# Altium schematic sheet Controller.SchDoc: Controle
size A4; ENG_APP_DATE: --/--/--; DSN_APP_DATE: --/--/--; CHK_APP_DATE: --/--/--; Date: *******; ApprovedBy: *******; CheckedBy: None; Author: *******; CompanyName: *******; Engineer: *******; Organization: *******; Address1: *******; Address2: *******; Address3: *******; Address4: *******; DocumentNumber: Doc Num; Revision: *******; SheetNumber: 2; SheetTotal: 7; CurrentTime: *******; CurrentDate: *******; Time: *******; DocumentFullPathAndName: *******; DocumentName: *******; ModifiedDate: *******; ImagePath: *******; ProjectName: *******; Application_BuildNumber: *******
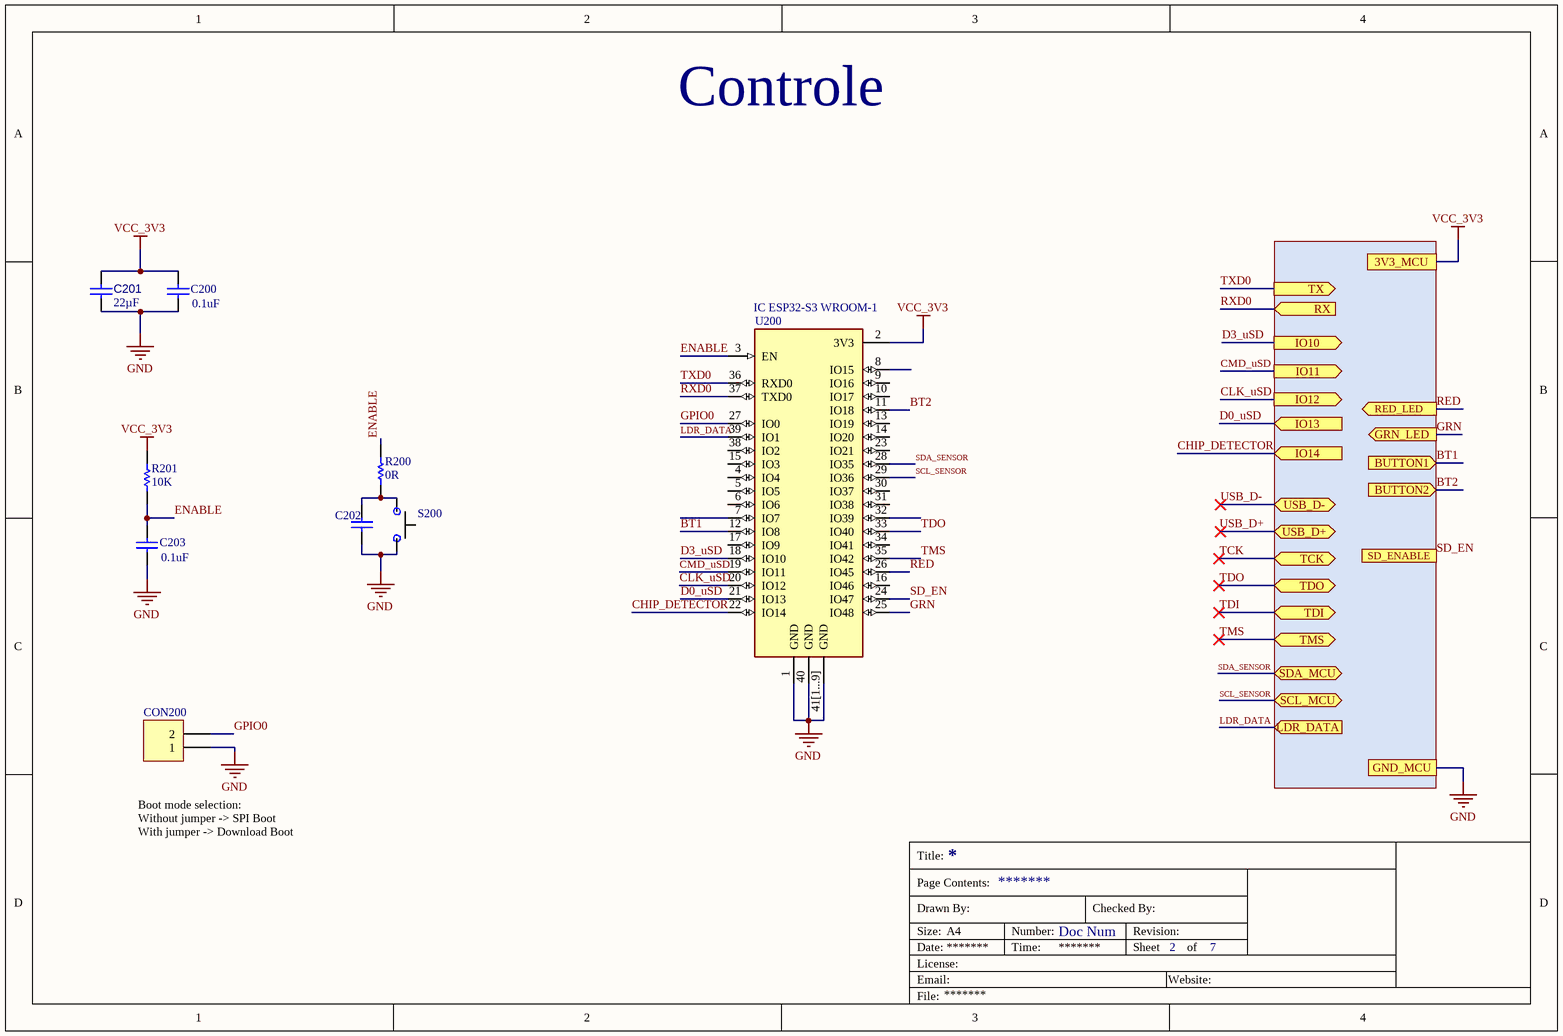
[diagram p0: Controller.SchDoc]

## Parts
C200  0.1uF  [CC2012-0805]
C201  value 22µF  [CC2012-0805]  (hidden comment: Capacitor 22µF +/-40% 16V 0805)
C202  CAP CER 0.1uF 100V X7R SMD 0805  [CC2012-0805]  (value not drawn)
C203  0.1uF  [CC2012-0805]
CON200  PIN HEADER 2POS  [FP-TSW-102-07-G-S-MFG]  (value not drawn)
R200  0R  [RESC2013X50X35ML15T15]
R201  10K  [CR2012-0805]
S200  SWITCH TACTILE SPST-NO 0.05A 12V SMD  [SWITCH_TACTILE_SMD_2PIN]  (value not drawn)
U200  IC ESP32-S3 WROOM-1  [ESP32_S3_WROOM_1]

## Ports
3V3_MCU, BUTTON1 (in), BUTTON2 (in), GND_MCU, GRN_LED (out), IO10 (out), IO11 (out), IO12 (out), IO13 (in), IO14 (in), LDR_DATA (in), RED_LED (out), RX (in), SCL_MCU (bidir), SD_ENABLE (out), SDA_MCU (bidir), TCK (bidir), TDI (bidir), TDO (bidir), TMS (bidir), TX (out), USB_D+ (bidir), USB_D- (bidir)

## Nets
GND: C200.1 C201.1 C202.1 C203.1 CON200.1 S200.1 U200.1(GND) U200.40(GND) U200.41[1...9](GND) ; port GND_MCU
VCC_3V3: C200.2 C201.2 R201.2 U200.2(3V3) ; port 3V3_MCU
BT1: U200.12(IO8) ; port BUTTON1
BT2: U200.11(IO18) ; port BUTTON2
CHIP_DETECTOR: U200.22(IO14) ; port IO14
CLK_uSD: U200.20(IO12) ; port IO12
CMD_uSD: U200.19(IO11) ; port IO11
D0_uSD: U200.21(IO13) ; port IO13
D3_uSD: U200.18(IO10) ; port IO10
ENABLE: C203.2 R200.2 R201.1 U200.3(EN)
GPIO0: CON200.2 U200.27(IO0)
GRN: U200.25(IO48) ; port GRN_LED
LDR_DATA: U200.39(IO1) ; port LDR_DATA
RED: U200.26(IO45) ; port RED_LED
RXD0: U200.37(TXD0) ; port RX
SCL_SENSOR: U200.29(IO36) ; port SCL_MCU
SD_EN: U200.24(IO47) ; port SD_ENABLE
SDA_SENSOR: U200.28(IO35) ; port SDA_MCU
TCK: port TCK
TDI: port TDI
TDO: U200.33(IO40) ; port TDO
TMS: U200.35(IO42) ; port TMS
TXD0: U200.36(RXD0) ; port TX
USB_D-: port USB_D-
NetC202_2: C202.2 R200.1 S200.2

Not connected (* = marked no-connect by the designer): U200 4(IO4) 5(IO5) 6(IO6) 7(IO7) 8(IO15) 9(IO16) 10(IO17) 13(IO19) 14(IO20) 15(IO3) 16(IO46) 17(IO9) 23(IO21) 30(IO37) 31(IO38) 32(IO39) 34(IO41) 38(IO2)

## Notes on the sheet
- (near CON200) Boot mode selection:
  Without jumper -> SPI Boot
  With jumper -> Download Boot
- Labels drawn without touching a wire or pin: USB_D+
- Title:
- Drawn By:
- Page Contents:
- Checked By:
- Size:
- Date:
- File:
- License:
- Email:
- A4
- Number:
- Time:
- Revision:
- Sheet
- Website:
- of

## Library data of the parts
C200 C202 C203 = CAP CER 0.1uF 25V 0805 SMD: Cap Ceramic 0.1uF 25V X7R 10% SMD 0805 125C Plastic T/R; Manufacturer: KEMET; Manufacturer Part Number: C0805C104K3RACTU; Capacitance: 100nF; Supplier 1: RSComponents; RoHS: Yes; Category: Ceramic Capacitors; Stock 1: 1910; Pricing 1: 10=0,13300, 100=0,12200, 250=0,11000, 500=0,09400, 1000=0,08300 (USD); Mount: PCB,Surface Mount; Case/Package: 0805; Case Code (Imperial): 0805; Case Code (Metric): 2012; Dielectric Material: Ceramic; Contact Plating: Tin,Matte; Min Operating Temperature: -55°C; Max Operating Temperature: 125°C; Packaging: Tape and Reel; Tolerance: 10%; Package Quantity: 4000; Voltage Rating: 25V; Series: C0805C; Voltage Rating (DC): 25V; Dielectric: X7R; Termination: SMD/SMT; Construction: Flat; Voltage: 25V; Length: 2mm; Width: 1.2mm; Height: 0.9mm; Depth: 1.25mm; Lead Pitch: 0.75mm; Radiation Hardening: No; RoHS Compliant: Yes; ComponentLink1URL: https://datasheet.ciiva.com/18193/getdatasheetpartid-385649-18193413.pdf?src-supplier=Verical; ComponentLink1Description: https://datasheet.ciiva.com/18193/getdatasheetpartid-385649-18193413.pdf?src-supplier=Verical; ComponentLink2URL: https://datasheet.ciiva.com/7842/kem-c1002-x7r-smd-7842536.pdf?src-supplier=Element14; ComponentLink2Description: https://datasheet.ciiva.com/7842/kem-c1002-x7r-smd-7842536.pdf?src-supplier=Element14; ComponentLink3URL: https://datasheet.ciiva.com/7842/kem-c1002-x7r-smd-7842538.pdf?src-supplier=Element14; ComponentLink3Description: https://datasheet.ciiva.com/7842/kem-c1002-x7r-smd-7842538.pdf?src-supplier=Element14; Supplier Part Number 1: 6480979
C201 = CMP-001-00081-6: Chip Capacitor, 22µF +/-40%, 16V, 0805, Thickness 1.45 mm; Tolerance: 5%; Mounting Technology: SMT; Min Operating Temperature: -55°C; Case/Package: 0805; Max Operating Temperature: 85°C; Voltage Rating: 16V; Pins: 2
CON200 = CMP-002-00076-1: Conn Unshrouded Header HDR 2 POS 2.54mm Solder ST Top Entry Thru-Hole Bulk; Manufacturer Part Number: TSW-102-07-G-S; Gender: Male; Connector Type: Male Pin; Max Current Rating: 7.6A; Number of Contacts: 2; Max Voltage Rating (AC): 550V; Length: 5.08mm; Depth: 2.54mm; Orientation: Straight; Termination: Solder; Packaging: Bulk; Number of Rows: 1; Contact Material: Bronze; Housing Color: Black; Pitch: 2.54mm; Contact Mating Length: 0.23inch; RoHS Compliant: Yes; Lead Free: Lead Free; Contact Type: Male Pin; Series: TSW; Contact Plating: Gold; Color: Black; Min Operating Temperature: -55°C; REACH SVHC: No SVHC; Housing Material: Polyester; Number of Positions: 2; Mount: Through Hole; Package Quantity: 1; Max Operating Temperature: 125°C
R200 = CMP-009-00001-6: Chip Resistor, 0 Ohm, +/- 1%, 125 mW, -55 to 155 degC, 0805 (2012 Metric); Power: 125mW; Voltage Rating: 150V; Value: 0; Case/Package: 0805; Tolerance: 1%; Pins: 2; Mounting Technology: SM; Max Operating Temperature: 155°C; Min Operating Temperature: -55°C; RoHS Compliant: True
R201 = CMP-018-000030-1: RES 0805 10K Ohm 0.1% 1/10W  SMD; Manufacturer Part Number: ERJ-6ENF1002V; Manufacturer: Panasonic Electronic Components; Number of Resistors: 1; Voltage Rating (DC): 150V; Max Power Dissipation: 125mW; Temperature Coefficient: ±100ppm/°C; Tolerance: ±1%; Resistance: 10kR; Power (Watts): 0.125W, 1/8W; ComponentLink6URL: https://datasheet.ciiva.com/16725/70260748-16725031.pdf?src-supplier=Allied+Electronics; Package / Case: 0805 (2012 Metric); Supplier Device Package: 0805; Resistance (Ohms): 10k; ComponentLink14Description: https://datasheet.ciiva.com/24440/eng-ds-1773270-l-24440188.pdf?src-supplier=Onlinecomponents.com; Operating Temperature: -55°C ~ 155°C; ComponentLink15Description: https://datasheet.ciiva.com/7731/eng-ds-1773270-l-7731311.pdf?src-supplier=Element14; ComponentLink7Description: https://datasheet.ciiva.com/46372/1678782-46372714.pdf?src-supplier=Element14; ComponentLink13Description: https://datasheet.ciiva.com/16723/70063741-16723029.pdf?src-supplier=Allied+Electronics; Contact Plating: Tin; Part Status: Active; ComponentLink11Description: https://datasheet.ciiva.com/30140/aoa0000ce2-30140236.pdf?src-supplier=Onlinecomponents.com; ComponentLink6Description: https://datasheet.ciiva.com/16725/70260748-16725031.pdf?src-supplier=Allied+Electronics; Lead Free: Lead Free; ComponentLink14URL: https://datasheet.ciiva.com/24440/eng-ds-1773270-l-24440188.pdf?src-supplier=Onlinecomponents.com; Design Item ID: RES 10K OHM 1% 1/8W 0805 SMD; ComponentLink7URL: https://datasheet.ciiva.com/46372/1678782-46372714.pdf?src-supplier=Element14; ComponentLink3Description: https://datasheet.ciiva.com/16514/aoa0000ce2-16514021.pdf?src-supplier=Avnet+Asia; Category: Resistors; ComponentLink13URL: https://datasheet.ciiva.com/16723/70063741-16723029.pdf?src-supplier=Allied+Electronics; Case Code (Imperial): 0805; Failure Rate: -; Stock 1: 2392770; ComponentLink5URL: https://datasheet.ciiva.com/16759/70260748-16759350.pdf?src-supplier=Allied+Electronics; Features: Automotive AEC-Q200; ComponentLink12URL: https://datasheet.ciiva.com/24070/aoa0000ce2-24070702.pdf?src-supplier=Mouser; ComponentLink9URL: https://datasheet.ciiva.com/7830/426256-7830745.pdf?src-supplier=Element14; Termination: SMD/SMT; ComponentLink10Description: https://datasheet.ciiva.com/17212/aoa0000ce2-17212108.pdf?src-supplier=Avnet+Europe; Length: 2mm; ComponentLink15URL: https://datasheet.ciiva.com/7731/eng-ds-1773270-l-7731311.pdf?src-supplier=Element14; ComponentLink8Description: https://datasheet.ciiva.com/46372/1678782-46372715.pdf?src-supplier=Element14; ComponentLink11URL: https://datasheet.ciiva.com/30140/aoa0000ce2-30140236.pdf?src-supplier=Onlinecomponents.com; Size / Dimension: 0.079" L x 0.049" W (2.00mm x 1.25mm); ComponentLink9Description: https://datasheet.ciiva.com/7830/426256-7830745.pdf?src-supplier=Element14; REACH SVHC: No SVHC; Source: mits.SchLib; Military Standard: Not; ComponentLink5Description: https://datasheet.ciiva.com/16759/70260748-16759350.pdf?src-supplier=Allied+Electronics; ComponentLink1Description: https://industrial.panasonic.com/cdbs/www-data/pdf/RDA0000/AOA0000C283.pdf; ComponentLink16URL: https://datasheet.ciiva.com/14181/jcrn73-data-e-14181423.pdf?src-supplier=Distrelec; Stock 2: 1650; Working Voltage: 150V; ComponentLink8URL: https://datasheet.ciiva.com/46372/1678782-46372715.pdf?src-supplier=Element14; ComponentLink10URL: https://datasheet.ciiva.com/17212/aoa0000ce2-17212108.pdf?src-supplier=Avnet+Europe; Number of Pins: 2; Height: 0.6mm; ComponentLink4Description: https://datasheet.ciiva.com/27055/1988971-27055733.pdf?src-supplier=Jameco; ComponentLink4URL: https://datasheet.ciiva.com/27055/1988971-27055733.pdf?src-supplier=Jameco; Pricing 2: 1=1,68000, 10=1,48900, 100=1,13720, 1000=0,73645 (USD); Radiation Hardening: No; ComponentLink16Description: https://datasheet.ciiva.com/14181/jcrn73-data-e-14181423.pdf?src-supplier=Distrelec; Pricing 1: 1=0.1, 10=0.036, 25=0.0264, 50=0.02, 100=0.0148, 250=0.01124, 500=0.009, 1000=0.00663 (USD); ELV: Compliant; Width: 0.049inch; RoHS: RoHS Compliant; Number of Terminations: 2; ComponentLink2Description: https://datasheet.ciiva.com/11808/0900766b80f80784-11808080.pdf?src-supplier=RSComponents; Power Rating: 125mW; ComponentLink1URL: https://industrial.panasonic.com/cdbs/www-data/pdf/RDA0000/AOA0000C283.pdf; Mount: Surface Mount; Depth: 1.25mm; Case Code (Metric): 2012; ComponentLink12Description: https://datasheet.ciiva.com/24070/aoa0000ce2-24070702.pdf?src-supplier=Mouser; ComponentLink3URL: https://datasheet.ciiva.com/16514/aoa0000ce2-16514021.pdf?src-supplier=Avnet+Asia; ComponentLink2URL: https://datasheet.ciiva.com/11808/0900766b80f80784-11808080.pdf?src-supplier=RSComponents; Height - Seated (Max): 0.028" (0.70mm); Composition: Thick Film; Case/Package: 0805; Max Operating Temperature: 155°C; Packaging: Cut Tape (CT); Package Quantity: 5000; Voltage Rating: 150V; Min Operating Temperature: -55°C
S200 = CMP-019-000011-1: Switch Tactile N.O. SPST Rectangular Button J-Lead 0.05A 12VDC 2.55N SMD T/R; Manufacturer Part Number: TL3302BF260QJ; Manufacturer: E-Switch; Current Rating: 50mA; Operating Force: 260gf; Switch Travel: 0.25mm; Switch Function: Off-Mom; Actuator Material: Polyphenylene; Mechanical Life: 30000Cycles; Illumination Type: Non-Illuminated; ComponentLink1URL: https://datasheet.ciiva.com/2900/p020333b-2900880.pdf?src-supplier=Digi-Key; Design Item ID: SWITCH TACTILE SPST-NO 0.05A 12V SMD; Min Operating Temperature: -20°C; RoHS Compliant: Yes; Voltage Rating (DC): 12V; ComponentLink1Description: https://datasheet.ciiva.com/2900/p020333b-2900880.pdf?src-supplier=Digi-Key; Size: 11.4mm; Package Quantity: 1; Contact Plating: Silver; Lead Free: Lead Free; Termination: Gull Wing; Series: TL3302; Mount: Surface Mount; RoHS: Yes; Category: Tactile Switches; Stock 1: 19576; Throw Configuration: SPST; Packaging: Tape and Reel; Pricing 1: 1=0,82000, 10=0,79300, 25=0,74120, 100=0,64360, 250=0,58564, 500=0,54294 (USD); Source: mits.SchLib; Max Operating Temperature: 70°C
U200 = IC ESP32 S3 WROOM-1_v2: SMD Module, ESP32-S3R2 With 8 MB of Flash; Manufacturer Part Number: ESP32-S3-WROOM-1-N8; MF: Espressif Systems; SnapEDA_Link: https://www.snapeda.com/parts/ESP32-S3-WROOM-1U/Espressif+Systems/view-part/?ref=snap; Availability: Not in stock; Package: Package; Price: None; Value: *; Check_prices: https://www.snapeda.com/parts/ESP32-S3-WROOM-1U/Espressif+Systems/view-part/?ref=eda; Manufacturer: Espressif Systems; RoHS: No; Category: Uncategorized; Stock 1: 659; Pricing 1: 1=3,63000 (USD); Supplier 1: Digi-Key; Supplier Part Number 1: 1965-ESP32-S3-WROOM-1-N8CT-ND